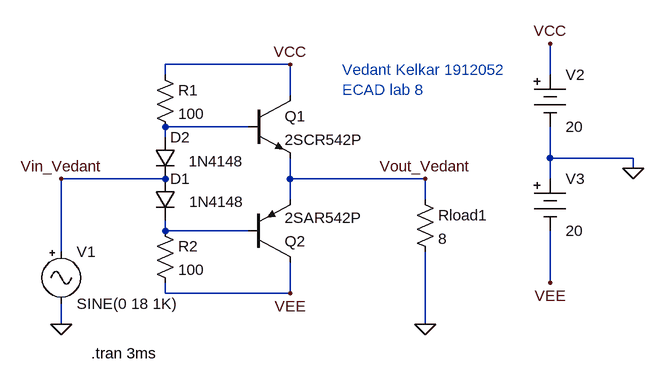
[diagram p0: schematic ECAD_Lab8b.asc]
ECAD_Lab8b.asc, the LTspice schematic file:
Version 4
SHEET 1 880 680
WIRE -16 -48 -208 -48
WIRE -208 -32 -208 -48
WIRE 384 -32 384 -80
WIRE -16 0 -16 -48
WIRE -80 48 -208 48
WIRE -208 64 -208 48
WIRE 384 96 384 48
WIRE 512 96 384 96
WIRE 512 112 512 96
WIRE -208 128 -368 128
WIRE -16 128 -16 96
WIRE 192 128 -16 128
WIRE 384 128 384 96
WIRE -16 160 -16 128
WIRE 192 160 192 128
WIRE -208 208 -208 192
WIRE -80 208 -208 208
WIRE -368 240 -368 128
WIRE 384 288 384 208
WIRE -208 304 -208 288
WIRE -16 304 -16 256
WIRE -16 304 -208 304
WIRE -368 352 -368 320
WIRE 192 352 192 240
FLAG 192 352 0
FLAG -368 352 0
FLAG 384 -80 VCC
FLAG -16 -48 VCC
FLAG 384 288 VEE
FLAG -16 304 VEE
FLAG 512 112 0
FLAG 192 128 Vout_Vedant
FLAG -368 128 Vin_Vedant
SYMBOL npn -80 0 R0
SYMATTR InstName Q1
SYMATTR Value 2SCR542P
SYMBOL pnp -80 256 M180
SYMATTR InstName Q2
SYMATTR Value 2SAR542P
SYMBOL res 176 144 R0
SYMATTR InstName Rload1
SYMATTR Value 8
SYMBOL Misc\\signal -368 224 R0
SYMATTR InstName V1
SYMATTR Value SINE(0 18 1K)
SYMBOL Misc\\battery 384 -48 R0
SYMATTR InstName V2
SYMATTR Value 20
SYMBOL Misc\\battery 384 112 R0
SYMATTR InstName V3
SYMATTR Value 20
SYMBOL res -224 -48 R0
SYMATTR InstName R1
SYMATTR Value 100
SYMBOL res -224 192 R0
SYMATTR InstName R2
SYMATTR Value 100
SYMBOL diode -224 128 R0
WINDOW 3 53 35 Left 2
SYMATTR InstName D1
SYMATTR Value 1N4148
SYMBOL diode -224 64 R0
WINDOW 3 52 37 Left 2
SYMATTR InstName D2
SYMATTR Value 1N4148
TEXT -322 396 Left 2 !.tran 3ms
TEXT 64 -40 Left 2 ;Vedant Kelkar 1912052\nECAD lab 8

The netlist it stands for:
* ECAD_Lab8b.asc
Q1 VCC N001 Vout_Vedant 0 2SCR542P
Q2 VEE N002 Vout_Vedant 0 2SAR542P
Rload1 Vout_Vedant 0 8
V1 Vin_Vedant 0 SINE(0 18 1K)
V2 VCC 0 20
V3 0 VEE 20
R1 VCC N001 100
R2 N002 VEE 100
D1 Vin_Vedant N002 1N4148
D2 N001 Vin_Vedant 1N4148
.model D D
.lib standard.dio
.model NPN NPN
.model PNP PNP
.lib standard.bjt
.tran 3ms
* Vedant Kelkar 1912052
* ECAD lab 8
.backanno
.end